# Altium schematic sheet RFID.SchDoc
size A
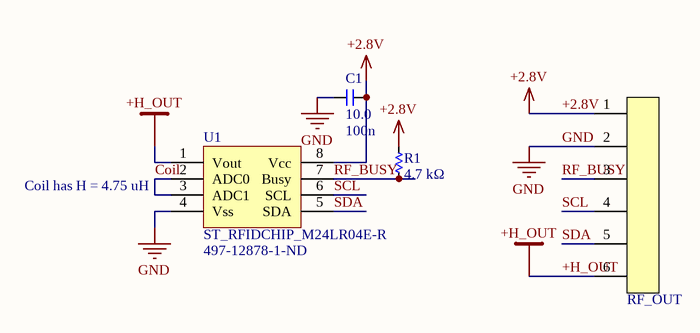
[diagram p0: RFID.SchDoc]

## Parts
C1  voltage: 10.0  human_value: 100n  [C0402]  (hidden comment: 399-3520-1-ND)
R1  Resistance: 4.7 kΩ  [R0805]  (hidden comment: __template_resistor)
RF_OUT  CONN HEADER 6POS RA SMT  [CONN_1X6_RA_SMT]  (value not drawn)
U1  ST_RFIDCHIP_M24LR04E-R  Supplier Part Number 1: 497-12878-1-ND  [M24LR04E-R SO8N]

## Nets
+2.8V: C1.2 R1.2 RF_OUT.1 U1.8(Vcc)
+H_OUT: RF_OUT.6 U1.1(Vout)
GND: C1.1 RF_OUT.2 U1.4(Vss)
Coil: U1.2(ADC0) U1.3(ADC1)
RF_BUSY: R1.1 RF_OUT.3 U1.7(Busy)
SCL: RF_OUT.4 U1.6(SCL)
SDA: RF_OUT.5 U1.5(SDA)

## Notes on the sheet
- (near U1) Coil has H = 4.75 uH

## Library data of the parts
C1 = 399-3520-1-ND: type: capacitor; value: 1e-07; tolerance: 10%; Supplier Part Number 1: 399-3520-1-ND; package: 0402; price: 0.06
R1 = RES SMD 4.7K OHM 1% 1/8W 0805: Manufacturer Part Number: RC0805FR-074K7L; Manufacturer: Yageo; Resistance (Sortable): 4700; Tolerance: ±1%; Power (Watts): 0.125W, 1/8W; Temperature Coefficient: ±100ppm/°C; Supplier 1: Digikey; Datasheets: http://www.yageo.com/documents/recent/PYu-RC_Group_51_RoHS_L_9.pdf; Image: //media.digikey.com/Renders/Yageo%20Renders/0805-(2012-Metric).jpg; Supplier Part Number 1: 311-4.70KCRCT-ND; Operating Temperature: -55°C ~ 155°C
RF_OUT = CONN_1x6_RA_SMT: Manufacturer: 3M; Manufacturer Part Number: 961106-5500-AR-PR; Connector Type: Header, Unshrouded; Number of Positions: 6; Number of Positions Loaded: All; Pitch: 0.100" (2.54mm); System: Connector; Supplier 1: Digi-Key; RoHS: RoHS Compliant; Category: Connectors, Interconnects; Stock 1: 4085; Pricing 1: 1=1.96, 10=1.779, 25=1.67, 50=1.5972, 100=1.5246, 250=1.3794 (USD); Packaging: Cut Tape (CT); Part Status: Active; Contact Type: Male Pin; Number of Rows: 1; Row Spacing: -; Contact Mating Length: 0.230" (5.84mm); Mounting Type: Surface Mount, Right Angle; Termination: Solder; Fastening Type: -; Features: -; Contact Finish: Gold; Contact Finish Thickness: Flash; Color: Black; ComponentLink1URL: http://multimedia.3m.com/mws/media/548463O/3mtm-pin-strip-header-ts2184.pdf; ComponentLink1Description: http://multimedia.3m.com/mws/media/548463O/3mtm-pin-strip-header-ts2184.pdf; Supplier Part Number 1: 3M9501CT-ND
U1 = ST_RFIDCHIP_M24LR04E-R: Dynamic NFC/RFID tag IC with 4-Kbit EEPROM,  energy harvesting, I²C bus and ISO 15693 RF interface; Manufacturer: STMicroelectronics; Manufacturer Part Number: M24LR04E-RMN6T/2; Frequency: 13.56MHz; Standards: ISO 15693, ISO 18000-3, NFC; Voltage - Supply: 1.8 V ~ 5.5 V; Supplier 1: Digi-Key; RoHS: RoHS Compliant; Category: RF/IF and RFID; Stock 1: 2742; Pricing 1: 1=0.72, 10=0.661, 100=0.5798, 500=0.5664, 1000=0.54597 (USD); Packaging: Cut Tape (CT); Part Status: Active; Type: RFID Transponder; Interface: I²C; Operating Temperature: -40°C ~ 85°C; Package / Case: 8-SOIC (0.154", 3.90mm Width); Supplier Device Package: 8-SO; ComponentLink1URL: http://www.st.com/content/ccc/resource/technical/document/datasheet/4e/fd/ac/70/b2/bc/43/fa/DM00038059.pdf/files/DM00038059.pdf/jcr:content/translations/en.DM00038059.pdf; ComponentLink1Description: http://www.st.com/content/ccc/resource/technical/document/datasheet/4e/fd/ac/70/b2/bc/43/fa/DM00038059.pdf/files/DM00038059.pdf/jcr:content/translations/en.DM00038059.pdf